# Altium schematic sheet Sensor.SchDoc
size A4
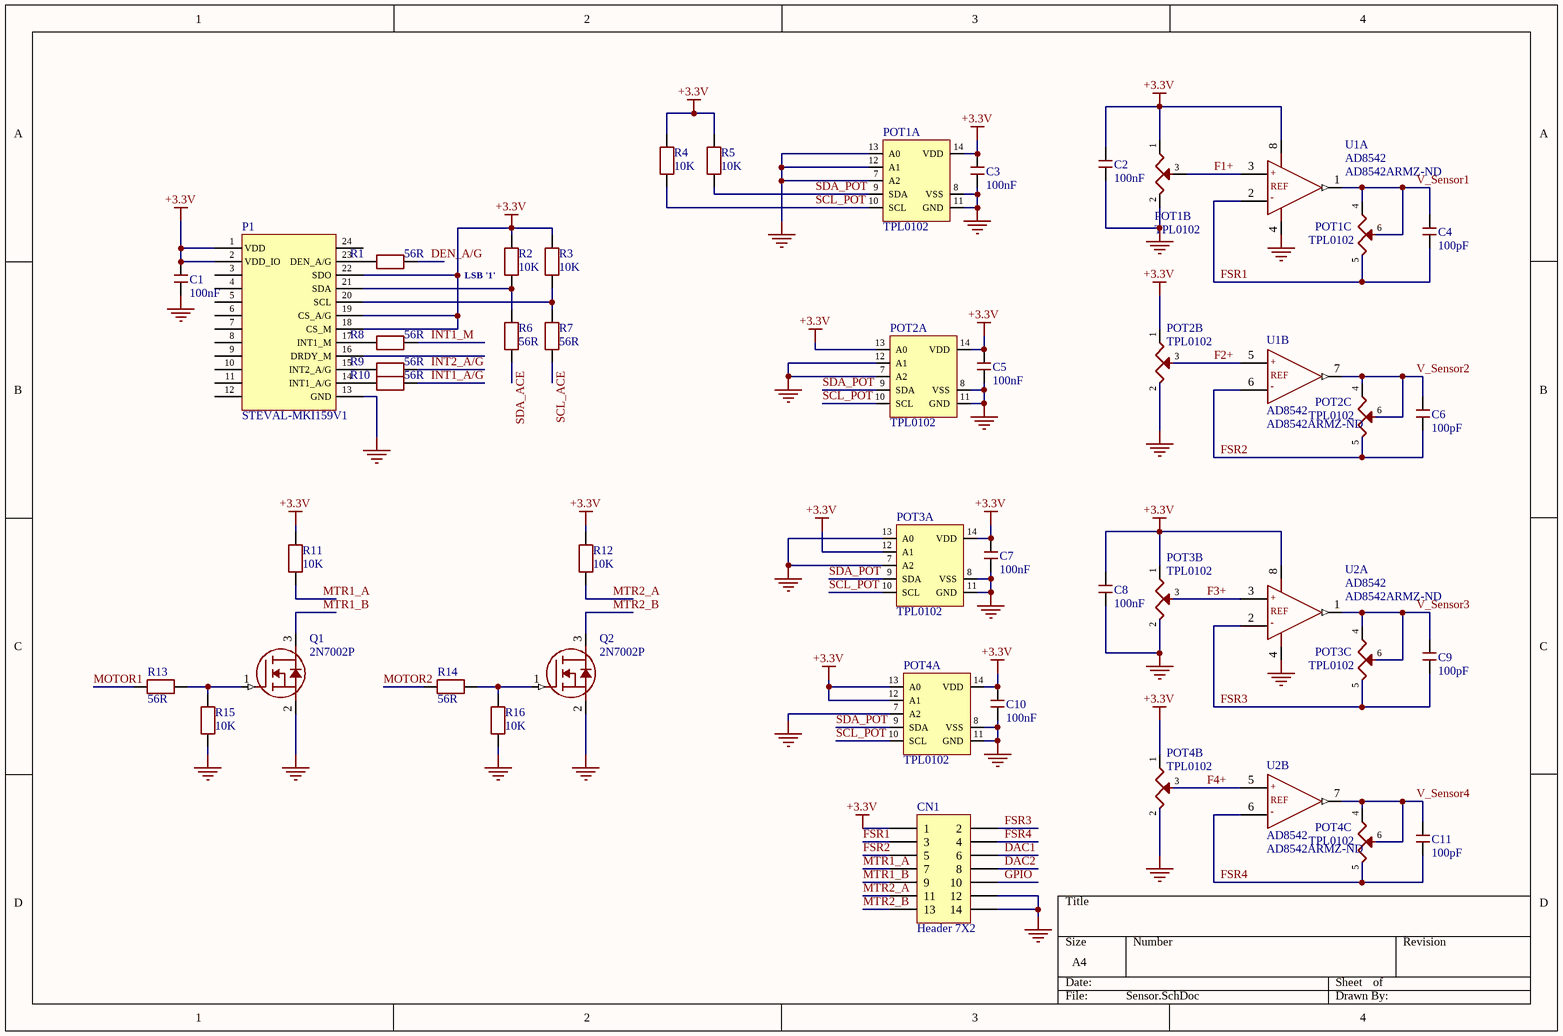
[diagram p0: Sensor.SchDoc]

## Parts
C1  100nF  [CAP0805[2012]MD-BO]
C2  100nF  [CAP0805[2012]MD-BO]
C3  100nF  [CAP0805[2012]MD-BO]
C4  100pF  [CAP0805[2012]MD-BO]
C5  100nF  [CAP0805[2012]MD-BO]
C6  100pF  [CAP0805[2012]MD-BO]
C7  100nF  [CAP0805[2012]MD-BO]
C8  100nF  [CAP0805[2012]MD-BO]
C9  100pF  [CAP0805[2012]MD-BO]
C10  100nF  [CAP0805[2012]MD-BO]
C11  100pF  [CAP0805[2012]MD-BO]
CN1  Header 7X2  [HDR2X7]
P1  STEVAL-MKI159V1  [STEVAL-MKI159V1 (2)]
POT1  TPL0102  [TPL0102]  (parts A,B,C of 3)
POT2  TPL0102  [TPL0102]  (parts A,B,C of 3)
POT3  TPL0102  [TPL0102]  (parts A,B,C of 3)
POT4  TPL0102  [TPL0102]  (parts A,B,C of 3)
Q1  2N7002P  [SOT23-3]
Q2  2N7002P  [SOT23-3]
R1  56R  [RES0805[2012]MD-BO]
R2  10K  [RES0805[2012]MD]
R3  10K  [RES0805[2012]MD]
R4  10K  [RES0805[2012]MD]
R5  10K  [RES0805[2012]MD]
R6  56R  [RES0805[2012]MD-BO]
R7  56R  [RES0805[2012]MD-BO]
R8  56R  [RES0805[2012]MD-BO]
R9  56R  [RES0805[2012]MD-BO]
R10  56R  [RES0805[2012]MD-BO]
R11  10K  [RES0805[2012]MD-BO]
R12  10K  [RES0805[2012]MD-BO]
R13  56R  [RES0805[2012]MD-BO]
R14  56R  [RES0805[2012]MD-BO]
R15  10K  [RES0805[2012]MD-BO]
R16  10K  [RES0805[2012]MD-BO]
U1  AD8542  Supplier Part Number 1: AD8542ARMZ-ND  [MSOP8]  (parts A,B of 2)
U2  AD8542  Supplier Part Number 1: AD8542ARMZ-ND  [MSOP8]  (parts A,B of 2)

## Nets
+3.3V: C1.1 C2.1 C3.1 C5.1 C7.1 C8.1 C10.1 CN1.1 P1.1(VDD) P1.2(VDD_IO) P1.18(CS_M) P1.19(CS_A/G) P1.22(SDO) POT1.1(HA) POT1.14(VDD) POT2.1(HA) POT2.13(A0) POT2.14(VDD) POT3.1(HA) POT3.12(A1) POT3.14(VDD) POT4.1(HA) POT4.12(A1) POT4.13(A0) POT4.14(VDD) R2.2 R3.2 R4.2 R5.2 R11.2 R12.2 U1.8(V+) U2.8(V+)
GND: C1.2 C2.2 C3.2 C5.2 C7.2 C8.2 C10.2 CN1.12 CN1.14 P1.13(GND) POT1.2(LA) POT1.7(A2) POT1.8(VSS) POT1.11(GND) POT1.12(A1) POT1.13(A0) POT2.2(LA) POT2.7(A2) POT2.8(VSS) POT2.11(GND) POT2.12(A1) POT3.2(LA) POT3.7(A2) POT3.8(VSS) POT3.11(GND) POT3.13(A0) POT4.2(LA) POT4.7(A2) POT4.8(VSS) POT4.11(GND) Q1.2(SOURCE) Q2.2(SOURCE) R15.1 R16.1 U1.4(V-) U2.4(V-)
DAC1: CN1.6
DAC2: CN1.8
DEN_A/G: R1.1
F1+: POT1.3(WA) U1.3(+IN_A)
F2+: POT2.3(WA) U1.5(+IN_B)
F3+: POT3.3(WA) U2.3(+IN_A)
F4+: POT4.3(WA) U2.5(+IN_B)
FSR1: C4.2 CN1.3 POT1.5(LB) U1.2(-IN_A)
FSR2: C6.2 CN1.5 POT2.5(LB) U1.6(-IN_B)
FSR3: C9.2 CN1.2 POT3.5(LB) U2.2(-IN_A)
FSR4: C11.2 CN1.4 POT4.5(LB) U2.6(-IN_B)
GPIO: CN1.10
INT1_A/G: R10.1
INT1_M: R8.1
INT2_A/G: R9.1
MOTOR1: R13.1
MOTOR2: R14.1
MTR1_A: CN1.7 R11.1
MTR1_B: CN1.9 Q1.3(DRAIN)
MTR2_A: CN1.11 R12.1
MTR2_B: CN1.13 Q2.3(DRAIN)
SCL_ACE: R7.2
SCL_POT: POT1.10(SCL) POT2.10(SCL) POT3.10(SCL) POT4.10(SCL) R4.1
SDA_ACE: R6.2
SDA_POT: POT1.9(SDA) POT2.9(SDA) POT3.9(SDA) POT4.9(SDA) R5.1
V_Sensor1: C4.1 POT1.4(HB) POT1.6(WB) U1.1(OUT_A)
V_Sensor2: C6.1 POT2.4(HB) POT2.6(WB) U1.7(OUT_B)
V_Sensor3: C9.1 POT3.4(HB) POT3.6(WB) U2.1(OUT_A)
V_Sensor4: C11.1 POT4.4(HB) POT4.6(WB) U2.7(OUT_B)
NetP1_14: P1.14(INT1_A/G) R10.2
NetP1_15: P1.15(INT2_A/G) R9.2
NetP1_17: P1.17(INT1_M) R8.2
NetP1_20: P1.20(SCL) R3.1 R7.1
NetP1_21: P1.21(SDA) R2.1 R6.1
NetP1_23: P1.23(DEN_A/G) R1.2
NetQ1_1: Q1.1(GATE) R13.2 R15.2
NetQ2_1: Q2.1(GATE) R14.2 R16.2

Not connected (* = marked no-connect by the designer): P1 3(NC) 4(NC) 5(NC) 6(NC) 7(NC) 8(NC) 9(NC) 10(NC) 11(NC) 12(NC) 16(DRDY_M) 24(NC)

## Notes on the sheet
- (near R2) LSB '1'
- (in symbol AD8542, part A) +; REF; -
- (in symbol AD8542, part B) +; REF; -

## Library data of the parts
C1-C3 C5 C7 C8 C10 = SMD 0805 100nF 50V 10% X7R: CERAMIC SMD 0805 100nF 50V 10% X7R; Manufacturer 1: Samsung Electro-Mechanics America, Inc.; Part Number 1: CL21B104KBFNNNG; Part Number 2: CL21B104KBCNNNC; Manufacturer 2: Samsung Electro-Mechanics America, Inc.; Part Number 3: 08055C104KAT2A; Manufacturer 3: AVX Corporation; Manufacturer 4: Kemet; Part Number 4: C0805C104K5RACTU; Manufacturer 5: Yageo; Part Number 5: CC0805KRX7R9BB104
C4 C6 C9 C11 = SMD 0805 100pF 50V 5% C0G: CERAMIC SMD 0805 100pF 50V 5% C0G; Manufacturer 1: Samsung Electro-Mechanics America, Inc.; Part Number 1: CL21C101JBANNNC; Part Number 2: GRM2165C1H101JA01D; Manufacturer 2: Murata Electronics North America; Part Number 3: CC0805JRNPO9BN101; Manufacturer 3: Yageo; Part Number 4: 08055A101JAT2A; Manufacturer 4: AVX Corporation; Part Number 5: C0805C101J5GACTU; Manufacturer 5: Kemet; Part Number 6: 500R15N101JV4T; Manufacturer 6: Johanson Dielectrics Inc.
CN1 = Header 7X2: Header, 7-Pin, Dual row; LatestRevisionDate: 17-Jul-2002; LatestRevisionNote: Re-released for DXP Platform.; Publisher: Altium Limited
P1 = STEVAL-MKI159V1: STEVAL-MKI159V1 MEMS; Supplier 1: Digi-Key; Supplier Part Number 1: 497-15392-ND
Q1 Q2 = 2N7002P,215: MOSFET N-CH 60V 360mA SOT23-3; Manufacturer 1: NXP; Part Number 1: 2N7002P,215
R1 R6-R10 R13 R14 = SMD 0805 56R 5% 0.125W: RESISTOR SMD 0805 56R 5% 0.125W; Manufacturer 1: Yageo; Part Number 1: RC0805JR-0756RL; Part Number 2: RC2012J560CS; Manufacturer 2: Samsung Electro-Mechanics America, Inc; Part Number 3: RMCF0805JT56R0; Manufacturer 3: Stackpole Electronics Inc; Part Number 4: MCR10ERTJ560; Manufacturer 4: Rohm Semiconductor; Part Number 5: ERJ-6GEYJ560V; Manufacturer 5: Panasonic Electronic Components
R2-R5 R11 R12 R15 R16 = SMD 0805 10K 5% 0.125W: RESISTOR SMD 0805 10K 5% 0.125W; Manufacturer 1: Yageo; Part Number 1: RC0805JR-0710KL; Part Number 2: RC2012J103CS; Manufacturer 2: Samsung Electro-Mechanics America, Inc; Part Number 3: RMCF0805JT10K0; Manufacturer 3: Stackpole Electronics Inc; Part Number 4: MCR10ERTJ103; Manufacturer 4: Rohm Semiconductor
POT1-POT4 = TPL0102: Supplier 1: Digi-Key; Supplier Part Number 1: 296-30048-2-ND
U1 U2 = AD8542: Supplier 1: Digi-Key